# Altium schematic sheet Sheet1.SchDoc
size A2
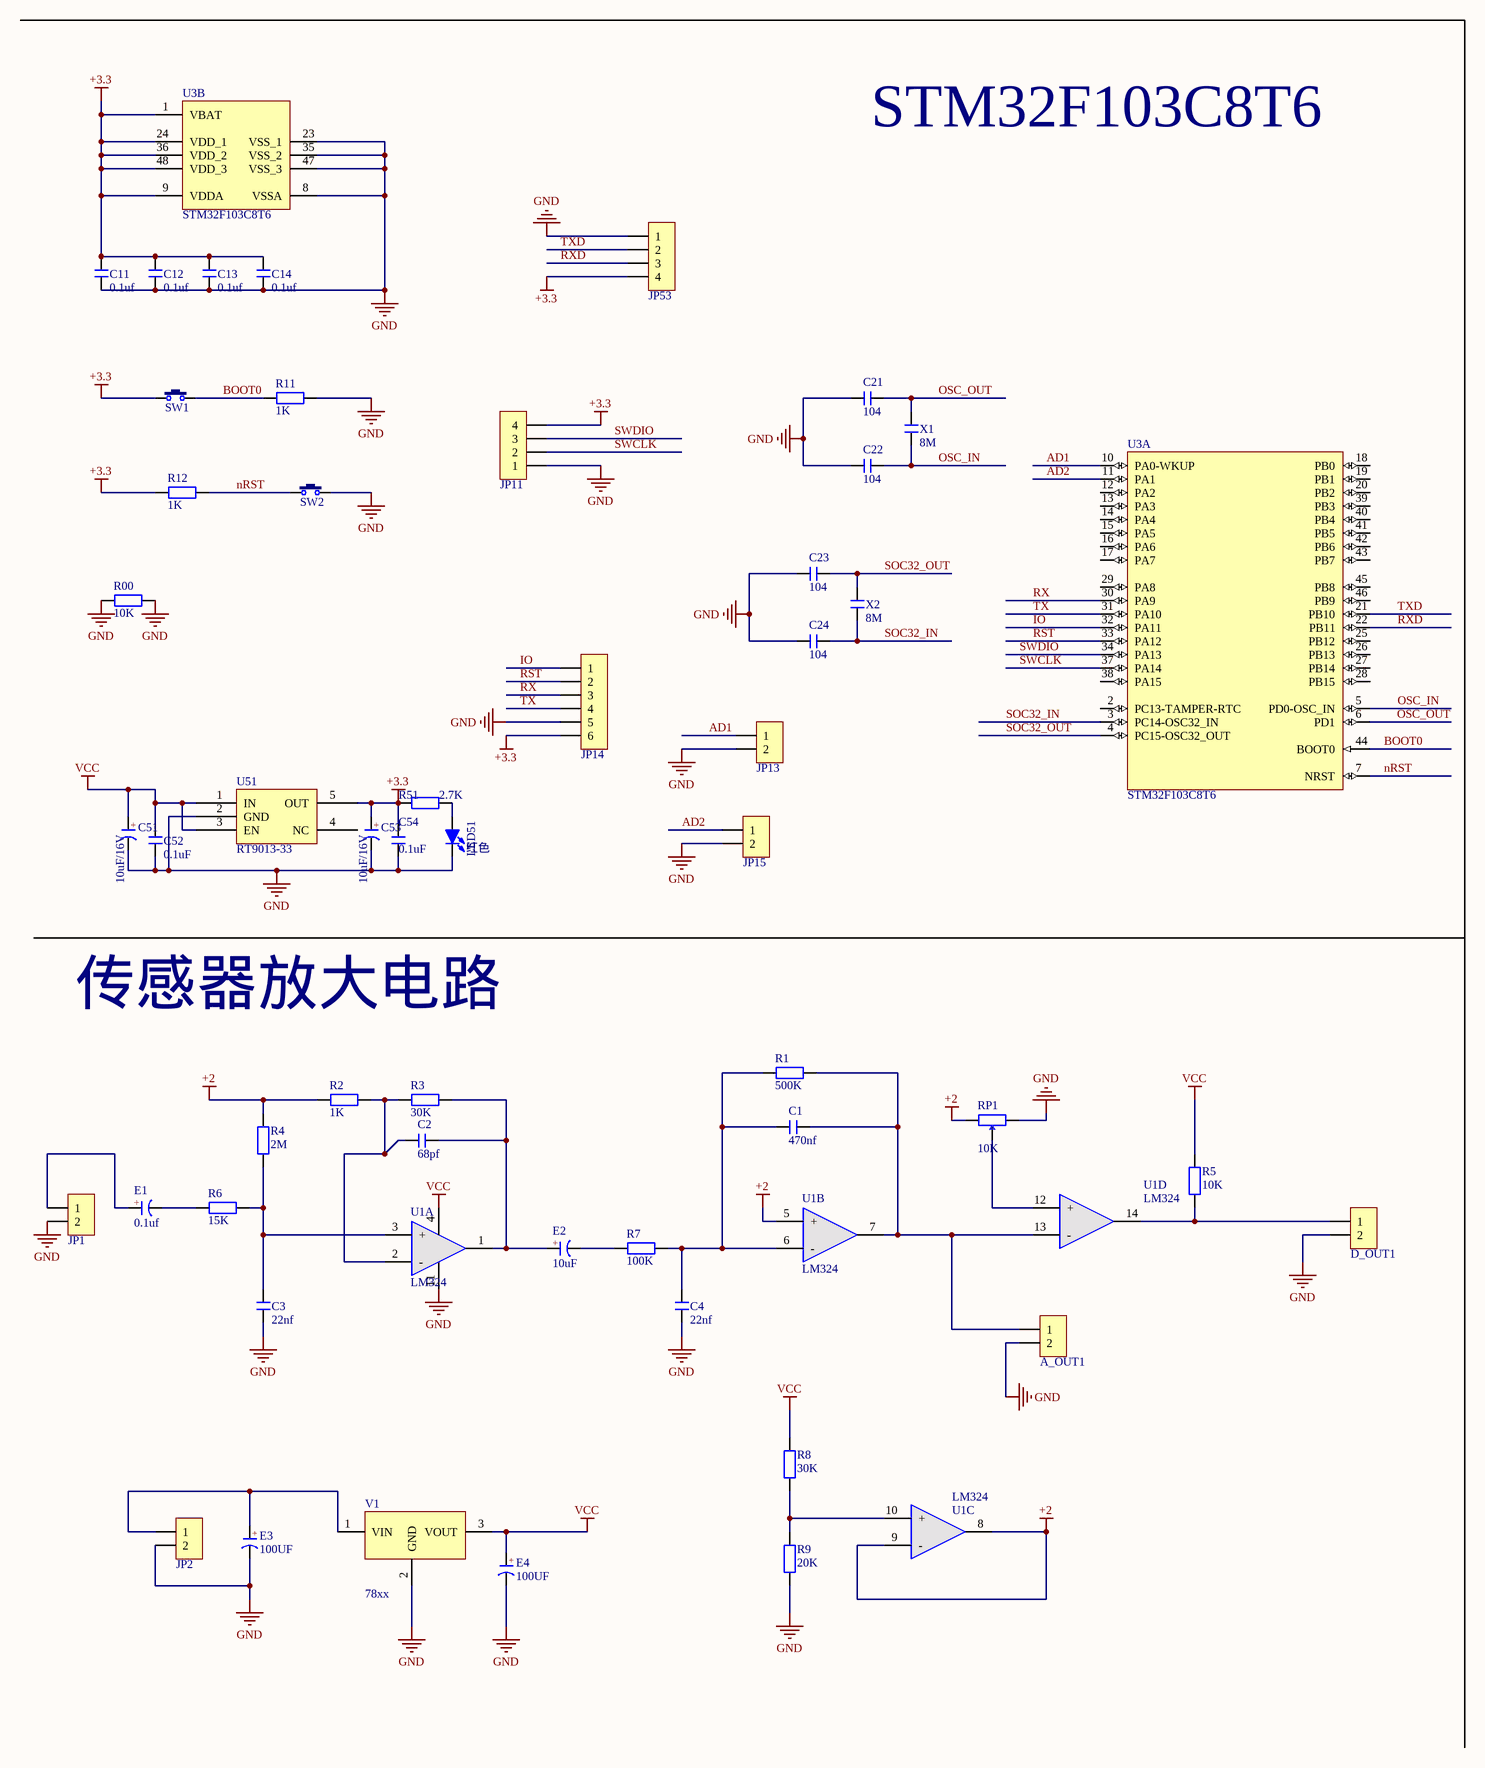
[diagram p0: Sheet1.SchDoc]

## Parts
A_OUT1  HDR-1X2  [XH2.54-WI-2P]  (value not drawn)
C1  470nf  [C 0805_L]
C2  68pf  [C 0805_L]
C3  22nf  [C 0805_L]
C4  22nf  [C 0805_L]
C11  0.1uf  [C 0805_L]
C12  0.1uf  [C 0805_L]
C13  0.1uf  [C 0805_L]
C14  0.1uf  [C 0805_L]
C21  104  [C 0805_L]
C22  104  [C 0805_L]
C23  104  [C 0805_L]
C24  104  [C 0805_L]
C51  10uF/16V  [CD A(3216)]
C52  0.1uF  [C 0805_L]
C53  10uF/16V  [CD A(3216)]
C54  0.1uF  [C 0805_L]
D_OUT1  HDR-1X2  [XH2.54-WI-2P]  (value not drawn)
E1  0.1uf  [CM B(4*5.4)]
E2  10uF  [CM B(4*5.4)]
E3  100UF  [CM B(4*5.4)]
E4  100UF  [CM B(4*5.4)]
JP1  HDR-1X2  [XH2.54-WI-2P]  (value not drawn)
JP2  HDR-1X2  [XH2.54-WI-2P]  (value not drawn)
JP11  HDR-1X4  [XH2.54-WI-4P]  (value not drawn)
JP13  HDR-1X2  [HDR2.54-LI-2P]  (value not drawn)
JP14  HDR-1X6  [HDR2.54-M-LI-6P]  (value not drawn)
JP15  HDR-1X2  [HDR2.54-LI-2P]  (value not drawn)
JP53  HDR-1X4  [HDR2.54-M-LI-4P]  (value not drawn)
LED51  红色  [LED 0805G]
R00  10K  [R 0805_L]
R1  500K  [R 0805_L]
R2  1K  [R 0805_L]
R3  30K  [R 0805_L]
R4  2M  [R 0805_L]
R5  10K  [R 0805_L]
R6  15K  [R 0805_L]
R7  100K  [R 0805_L]
R8  30K  [R 0805_L]
R9  20K  [R 0805_L]
R11  1K  [R 0805_L]
R12  1K  [R 0805_L]
R51  2.7K  [R 0805_L]
RP1  10K  [3296W]
SW1  3x6x5  [TSW SMD-3*6*2.5]  (value not drawn)
SW2  3x6x5  [TSW SMD-3*6*2.5]  (value not drawn)
U1  LM324  [SOP14_M]  (parts A,B,C,D of 4)
U3  STM32F103C8T6  [LQFP48_N]  (parts A,B of 2)
U51  RT9013-33  [SOT23-5]
V1  78xx  [TO252]
X1  8M  [C 1206_M]
X2  8M  [C 1206_M]

## Nets
+2: R2.1 R4.2 RP1.3 U1.5(+) U1.8(OUT) U1.9(-)
+3.3: C11.2 C12.2 C13.2 C14.2 C53.1(A) C54.2 JP11.4 JP14.6 JP53.4 R12.1 R51.1 SW1.1 U3.1(VBAT) U3.9(VDDA) U3.24(VDD_1) U3.36(VDD_2) U3.48(VDD_3) U51.5(OUT)
GND: A_OUT1.2 C3.1 C4.1 C11.1 C12.1 C13.1 C14.1 C21.1 C22.1 C23.1 C24.1 C51.2(K) C52.1 C53.2(K) C54.1 D_OUT1.2 E3.2(K) E4.2(K) JP1.2 JP2.2 JP11.1 JP13.2 JP14.5 JP15.2 JP53.1 LED51.2(K) R00.1 R00.2 R9.1 R11.2 RP1.1 SW2.2 U1.11(V-) U3.8(VSSA) U3.23(VSS_1) U3.35(VSS_2) U3.47(VSS_3) U51.2(GND) V1.2(GND)
VCC: C51.1(A) C52.2 E4.1(A) R5.2 R8.2 U1.4(V+) U51.1(IN) U51.3(EN) V1.3(VOUT)
AD1: JP13.1 U3.10(PA0-WKUP)
AD2: JP15.1 U3.11(PA1)
BOOT0: R11.1 SW1.2 U3.44(BOOT0)
IO: JP14.1 U3.32(PA11)
nRST: R12.2 SW2.1 U3.7(NRST)
OSC_IN: C22.2 U3.5(PD0-OSC_IN) X1.1
OSC_OUT: C21.2 U3.6(PD1) X1.2
RST: JP14.2 U3.33(PA12)
RX: JP14.3 U3.30(PA9)
RXD: JP53.3 U3.22(PB11)
SOC32_IN: C24.2 U3.3(PC14-OSC32_IN) X2.1
SOC32_OUT: C23.2 U3.4(PC15-OSC32_OUT) X2.2
SWCLK: JP11.2 U3.37(PA14)
SWDIO: JP11.3 U3.34(PA13)
TX: JP14.4 U3.31(PA10)
TXD: JP53.2 U3.21(PB10)
NetA_OUT1_1: A_OUT1.1 C1.2 R1.2 U1.7(OUT) U1.13(-)
NetC1_1: C1.1 C4.2 R1.1 R7.2 U1.6(-)
NetC2_1: C2.1 R2.2 R3.1 U1.2(-)
NetC2_2: C2.2 E2.1(A) R3.2 U1.1(OUT)
NetC3_2: C3.2 R4.1 R6.2 U1.3(+)
NetD_OUT1_1: D_OUT1.1 R5.1 U1.14(OUT)
NetE1_1: E1.1(A) JP1.1
NetE1_2: E1.2(K) R6.1
NetE2_2: E2.2(K) R7.1
NetE3_1: E3.1(A) JP2.1 V1.1(VIN)
NetLED51_1: LED51.1(A) R51.2
NetR8_1: R8.1 R9.2 U1.10(+)
NetRP1_2: RP1.2 U1.12(+)

Not connected (* = marked no-connect by the designer): U3 2(PC13-TAMPER-RTC) 12(PA2) 13(PA3) 14(PA4) 15(PA5) 16(PA6) 17(PA7) 18(PB0) 19(PB1) 20(PB2) 25(PB12) 26(PB13) 27(PB14) 28(PB15) 29(PA8) 38(PA15) 39(PB3) 40(PB4) 41(PB5) 42(PB6) 43(PB7) 45(PB8) 46(PB9); U51 4(NC)

## Notes on the sheet
- STM32F103C8T6
- 传感器放大电路
- (in symbol CE_SMD) +
- (in symbol CT) +

## Library data of the parts
A_OUT1 D_OUT1 JP1 JP2 JP13 JP15 = Header 2: 2P接插件; 版权归属: 封装库来自淘宝 ID：黄晶宝石; BOM名称: 2P接插件; 联系售后: https://shop463601444.taobao.com
C1-C4 C11-C14 C21-C24 C52 C54 X1 X2 = C: 贴片电容; BOM名称: 无极性贴片电容; 淘宝ID: 封装库来自淘宝 ID：黄晶宝石; 联系售后: https://shop463601444.taobao.com
C51 C53 = CT: 贴片钽电容; 淘宝ID: 封装库来自淘宝 ID：黄晶宝石; BOM名称: 贴片钽电容; 联系售后: https://shop463601444.taobao.com
E1-E4 = CE_SMD: 贴片电解电容; 版权归属: 封装库来自淘宝 ID：黄晶宝石; BOM名称: 贴片电解电容; 联系售后: https://shop463601444.taobao.com
JP11 JP53 = Header 4: 4P接插件; 版权归属: 封装库来自淘宝 ID：黄晶宝石; BOM名称: 4P接插件; 学习资源: https://shop463601444.taobao.com
JP14 = Header 6: 6P接插件; 版权归属: 封装库来自淘宝 ID：黄晶宝石; BOM名称: 6P接插件; 学习资源: https://shop463601444.taobao.com
LED51 = LED-SMD: 贴片LED; 版权归属: 封装库来自淘宝 ID：黄晶宝石; BOM名称: 贴片LED; 学习资源: https://shop463601444.taobao.com
R00-R9 R11 R12 R51 = R: 贴片电阻; 版权归属: 来自淘宝 ID：黄晶宝石; BOM名称: 贴片电阻; 联系售后: https://shop463601444.taobao.com
RP1 = RP: 单联电位器; BOM名称: 插件电位器; 版权归属: 封装库来自淘宝 ID：黄晶宝石; 联系售后: https://shop463601444.taobao.com
SW1 SW2 = TSW 3x6: 3x6轻触开关; 版权归属: 封装库来自淘宝 ID：黄晶宝石; BOM名称: 3x6轻触开关; 学习资源: www.ooocke.com
U1 = LM324: 4运放
U3 = STM32F103C8T6: STM32 ARM-based 32-bit MCU Performance Line with 64 kB Flash, 20 kB Internal RAM, -40 to +85癈 Temperature, 48-Pin LQFP, Tray; DatasheetVersion: rev13.0, Apr-2011; PackageVersion: rev13, Apr-2011; PackageReference: LQFP48; PackageDescription: 48-Pin Low-Profile Quad Flat Pack, 7 x 7 mm Body, 0.5 mm Pitch (LQFP48); ComponentLink1Description: Manufacturer URL; ComponentLink1URL: http://www.st.com/; ComponentLink2Description: STM32F103 Datasheet; ComponentLink2URL: http://www.st.com/internet/com/TECHNICAL_RESOURCES/TECHNICAL_LITERATURE/DATASHEET/CD00161566.pdf; ComponentLink3Description: STM32 Family Web Page; ComponentLink3URL: www.st.com/stm32; 联系售后: https://shop463601444.taobao.com
U51 = RT9013-33: 稳压芯片
V1 = 78xx: 线性稳压芯片; 淘宝ID: 封装库来自淘宝 ID：黄晶宝石; BOM名称: 线性稳压芯片; 联系售后: https://shop463601444.taobao.com